# EAGLE design pam-controller (EAGLE 9.6.2)
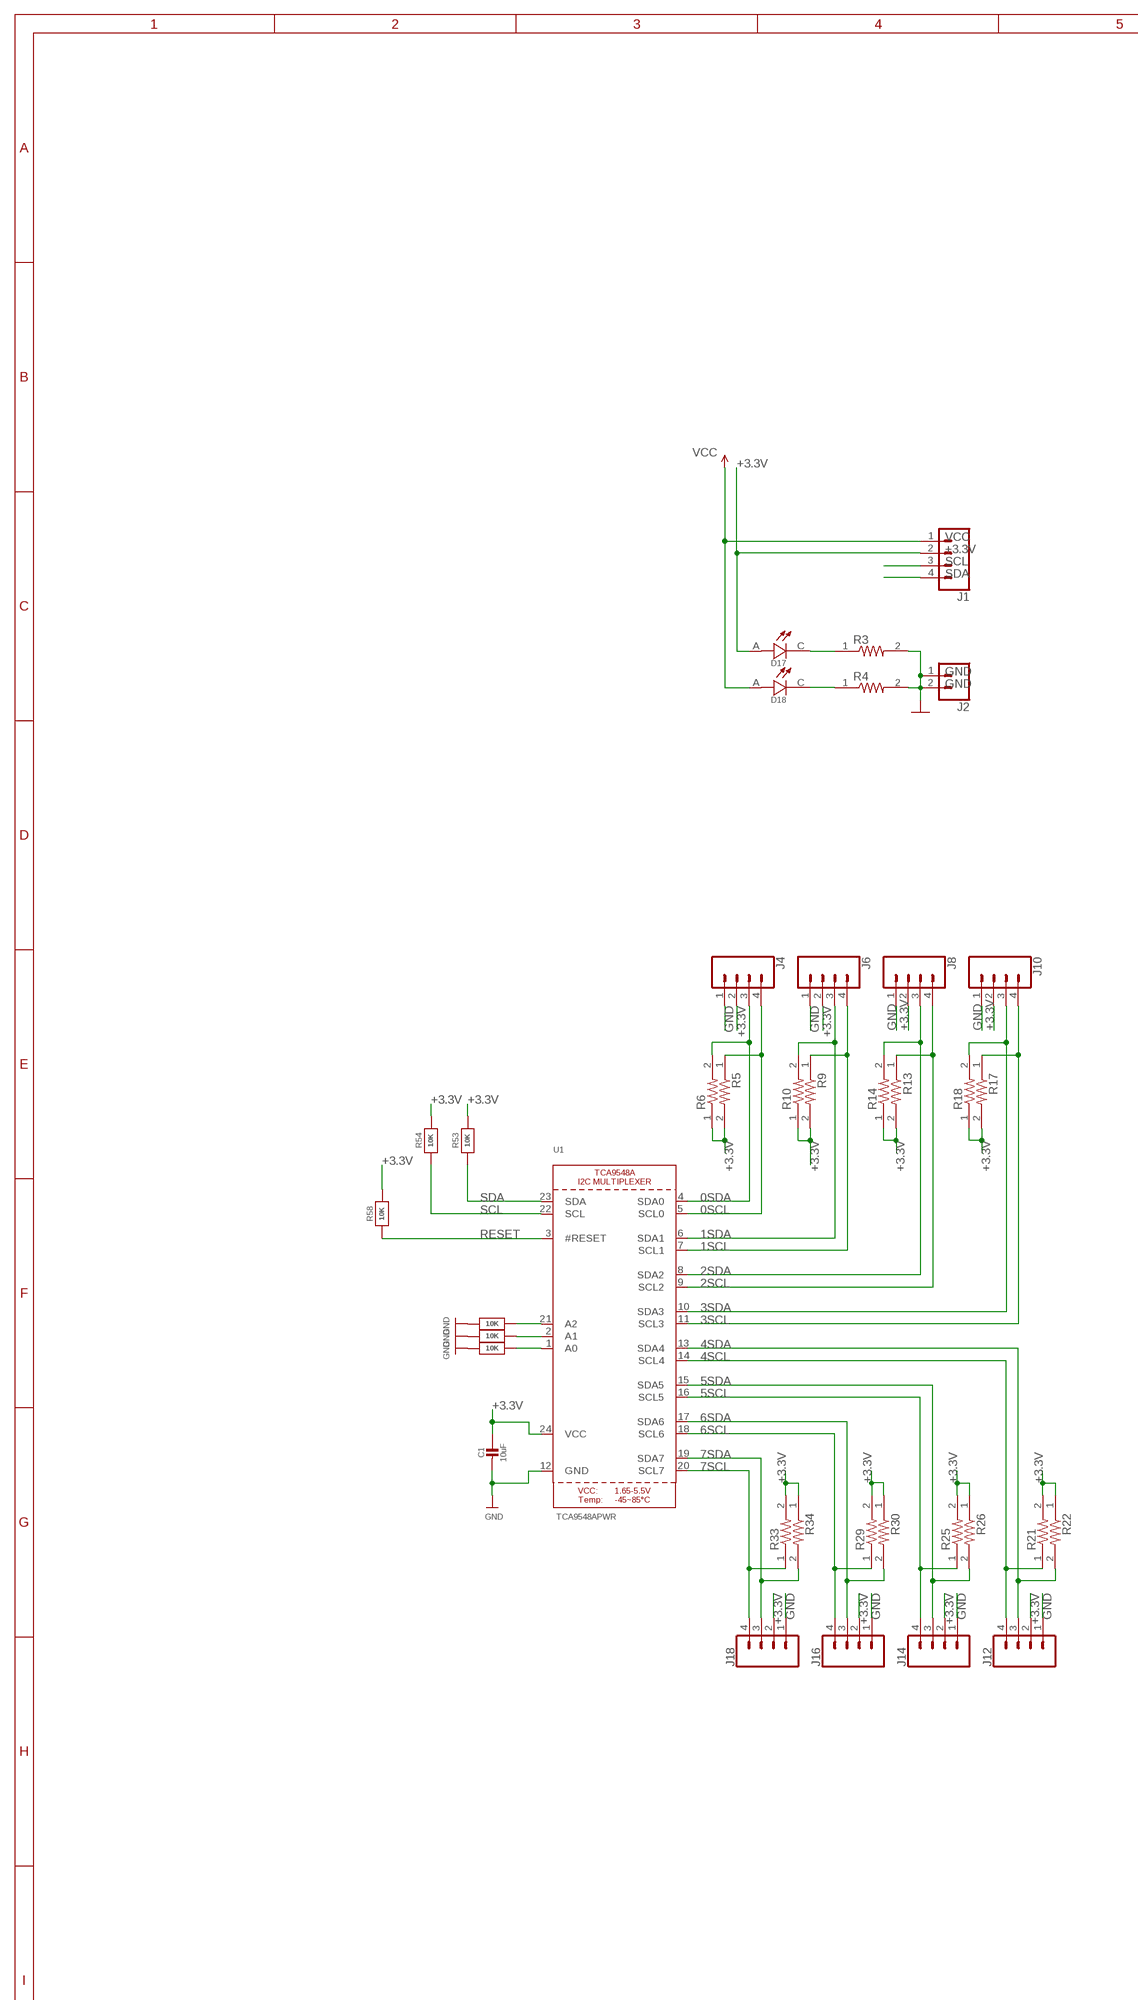
[diagram p0: schematic, sheet 1, part 1 of 2]
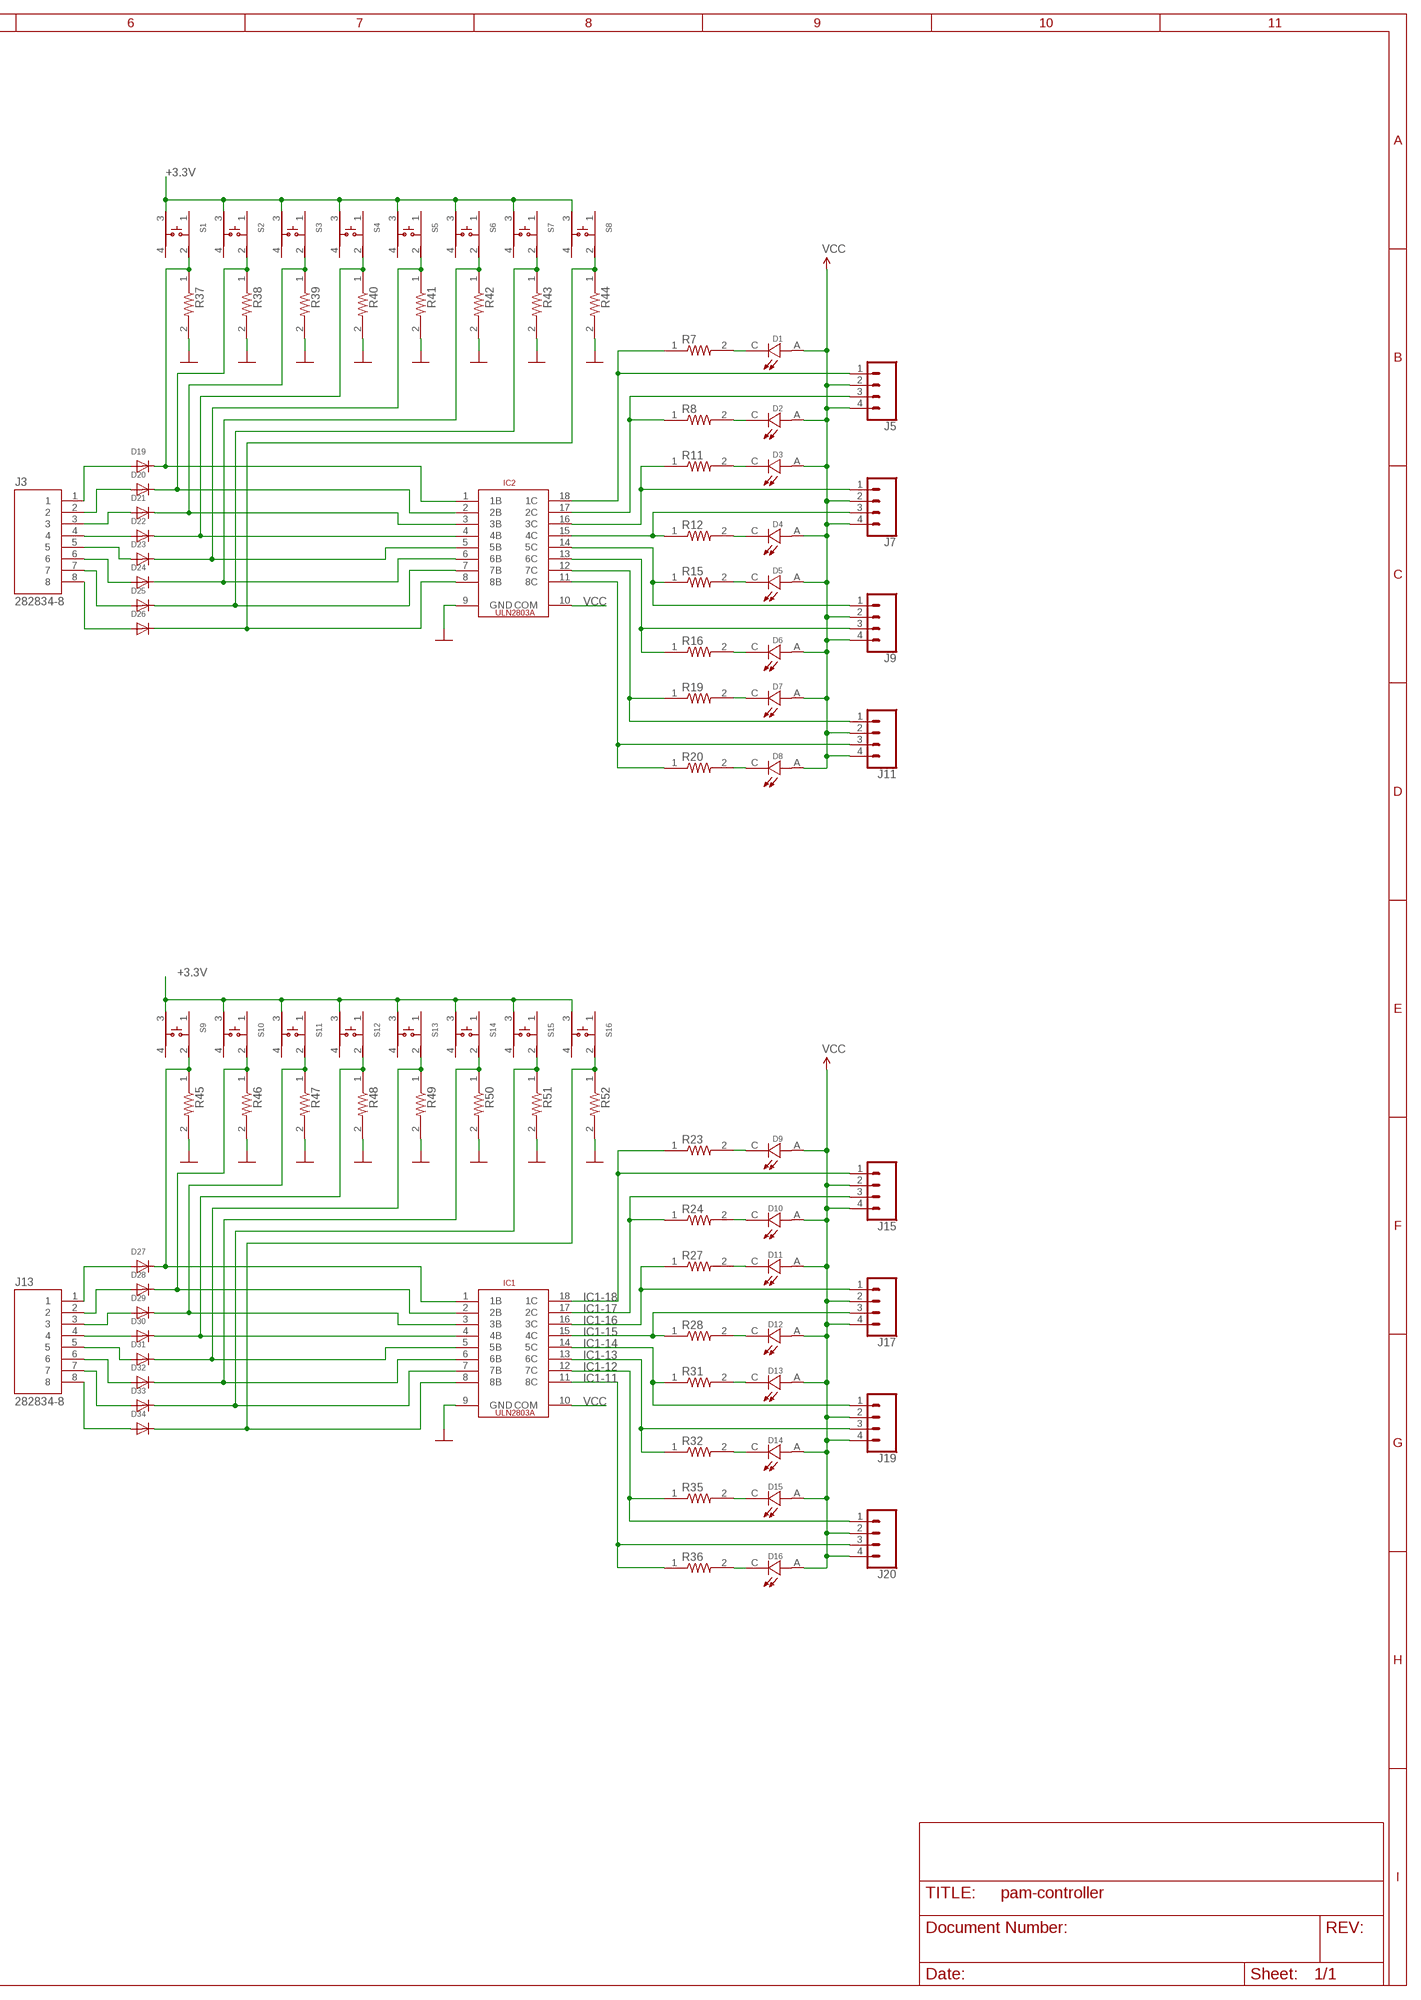
[diagram p1: schematic, sheet 1, part 2 of 2]

## Parts
C1  10uF  CAP_CERAMIC0805-NOOUTLINE  [0805-NO]
D1  LTST-C190KGKT  [LEDC1608X35N]
D2  LTST-C190KGKT  [LEDC1608X35N]
D3  LTST-C190KGKT  [LEDC1608X35N]
D4  LTST-C190KGKT  [LEDC1608X35N]
D5  LTST-C190KGKT  [LEDC1608X35N]
D6  LTST-C190KGKT  [LEDC1608X35N]
D7  LTST-C190KGKT  [LEDC1608X35N]
D8  LTST-C190KGKT  [LEDC1608X35N]
D9  LTST-C190KGKT  [LEDC1608X35N]
D10  LTST-C190KGKT  [LEDC1608X35N]
D11  LTST-C190KGKT  [LEDC1608X35N]
D12  LTST-C190KGKT  [LEDC1608X35N]
D13  LTST-C190KGKT  [LEDC1608X35N]
D14  LTST-C190KGKT  [LEDC1608X35N]
D15  LTST-C190KGKT  [LEDC1608X35N]
D16  LTST-C190KGKT  [LEDC1608X35N]
D17  LTST-C190KGKT  [LEDC1608X35N]
D18  LTST-C190KGKT  [LEDC1608X35N]
D19  DIODESOD-523  [SOD-523]
D20  DIODESOD-523  [SOD-523]
D21  DIODESOD-523  [SOD-523]
D22  DIODESOD-523  [SOD-523]
D23  DIODESOD-523  [SOD-523]
D24  DIODESOD-523  [SOD-523]
D25  DIODESOD-523  [SOD-523]
D26  DIODESOD-523  [SOD-523]
D27  DIODESOD-523  [SOD-523]
D28  DIODESOD-523  [SOD-523]
D29  DIODESOD-523  [SOD-523]
D30  DIODESOD-523  [SOD-523]
D31  DIODESOD-523  [SOD-523]
D32  DIODESOD-523  [SOD-523]
D33  DIODESOD-523  [SOD-523]
D34  DIODESOD-523  [SOD-523]
IC1  ULN2803A  [ULN2803A]
IC2  ULN2803A  [ULN2803A]
J1  CONN_04POLAR  [MOLEX-1X4]
J2  CONN_02POLAR  [MOLEX-1X2]
J3  282834-8  [TE_282834-8]
J4  CONN_04POLAR  [MOLEX-1X4]
J5  CONN_04POLAR  [MOLEX-1X4]
J6  CONN_04POLAR  [MOLEX-1X4]
J7  CONN_04POLAR  [MOLEX-1X4]
J8  CONN_04POLAR  [MOLEX-1X4]
J9  CONN_04POLAR  [MOLEX-1X4]
J10  CONN_04POLAR  [MOLEX-1X4]
J11  CONN_04POLAR  [MOLEX-1X4]
J12  CONN_04POLAR  [MOLEX-1X4]
J13  282834-8  [TE_282834-8]
J14  CONN_04POLAR  [MOLEX-1X4]
J15  CONN_04POLAR  [MOLEX-1X4]
J16  CONN_04POLAR  [MOLEX-1X4]
J17  CONN_04POLAR  [MOLEX-1X4]
J18  CONN_04POLAR  [MOLEX-1X4]
J19  CONN_04POLAR  [MOLEX-1X4]
J20  CONN_04POLAR  [MOLEX-1X4]
R3  1K  RC0603FR-071KL  [RESC1607X60N]
R4  1K  RC0603FR-071KL  [RESC1607X60N]
R5  1K  RC0603FR-071KL  [RESC1607X60N]
R6  1K  RC0603FR-071KL  [RESC1607X60N]
R7  1K  RC0603FR-071KL  [RESC1607X60N]
R8  1K  RC0603FR-071KL  [RESC1607X60N]
R9  1K  RC0603FR-071KL  [RESC1607X60N]
R10  1K  RC0603FR-071KL  [RESC1607X60N]
R11  1K  RC0603FR-071KL  [RESC1607X60N]
R12  1K  RC0603FR-071KL  [RESC1607X60N]
R13  1K  RC0603FR-071KL  [RESC1607X60N]
R14  1K  RC0603FR-071KL  [RESC1607X60N]
R15  1K  RC0603FR-071KL  [RESC1607X60N]
R16  1K  RC0603FR-071KL  [RESC1607X60N]
R17  1K  RC0603FR-071KL  [RESC1607X60N]
R18  1K  RC0603FR-071KL  [RESC1607X60N]
R19  1K  RC0603FR-071KL  [RESC1607X60N]
R20  1K  RC0603FR-071KL  [RESC1607X60N]
R21  1K  RC0603FR-071KL  [RESC1607X60N]
R22  1K  RC0603FR-071KL  [RESC1607X60N]
R23  1K  RC0603FR-071KL  [RESC1607X60N]
R24  1K  RC0603FR-071KL  [RESC1607X60N]
R25  1K  RC0603FR-071KL  [RESC1607X60N]
R26  1K  RC0603FR-071KL  [RESC1607X60N]
R27  1K  RC0603FR-071KL  [RESC1607X60N]
R28  1K  RC0603FR-071KL  [RESC1607X60N]
R29  1K  RC0603FR-071KL  [RESC1607X60N]
R30  1K  RC0603FR-071KL  [RESC1607X60N]
R31  1K  RC0603FR-071KL  [RESC1607X60N]
R32  1K  RC0603FR-071KL  [RESC1607X60N]
R33  1K  RC0603FR-071KL  [RESC1607X60N]
R34  1K  RC0603FR-071KL  [RESC1607X60N]
R35  1K  RC0603FR-071KL  [RESC1607X60N]
R36  1K  RC0603FR-071KL  [RESC1607X60N]
R37  1K  RC0603FR-071KL  [RESC1607X60N]
R38  1K  RC0603FR-071KL  [RESC1607X60N]
R39  1K  RC0603FR-071KL  [RESC1607X60N]
R40  1K  RC0603FR-071KL  [RESC1607X60N]
R41  1K  RC0603FR-071KL  [RESC1607X60N]
R42  1K  RC0603FR-071KL  [RESC1607X60N]
R43  1K  RC0603FR-071KL  [RESC1607X60N]
R44  1K  RC0603FR-071KL  [RESC1607X60N]
R45  1K  RC0603FR-071KL  [RESC1607X60N]
R46  1K  RC0603FR-071KL  [RESC1607X60N]
R47  1K  RC0603FR-071KL  [RESC1607X60N]
R48  1K  RC0603FR-071KL  [RESC1607X60N]
R49  1K  RC0603FR-071KL  [RESC1607X60N]
R50  1K  RC0603FR-071KL  [RESC1607X60N]
R51  1K  RC0603FR-071KL  [RESC1607X60N]
R52  1K  RC0603FR-071KL  [RESC1607X60N]
R53  10K  RESISTOR0805_NOOUTLINE  [0805-NO]
R54  10K  RESISTOR0805_NOOUTLINE  [0805-NO]
R55  10K  RESISTOR0805_NOOUTLINE  [0805-NO]
R56  10K  RESISTOR0805_NOOUTLINE  [0805-NO]
R57  10K  RESISTOR0805_NOOUTLINE  [0805-NO]
R58  10K  RESISTOR0805_NOOUTLINE  [0805-NO]
S1  SKRPACE010  [SW_SKRPACE010]
S2  SKRPACE010  [SW_SKRPACE010]
S3  SKRPACE010  [SW_SKRPACE010]
S4  SKRPACE010  [SW_SKRPACE010]
S5  SKRPACE010  [SW_SKRPACE010]
S6  SKRPACE010  [SW_SKRPACE010]
S7  SKRPACE010  [SW_SKRPACE010]
S8  SKRPACE010  [SW_SKRPACE010]
S9  SKRPACE010  [SW_SKRPACE010]
S10  SKRPACE010  [SW_SKRPACE010]
S11  SKRPACE010  [SW_SKRPACE010]
S12  SKRPACE010  [SW_SKRPACE010]
S13  SKRPACE010  [SW_SKRPACE010]
S14  SKRPACE010  [SW_SKRPACE010]
S15  SKRPACE010  [SW_SKRPACE010]
S16  SKRPACE010  [SW_SKRPACE010]
U1  TCA9548APWR  TCA9548A  [TSSOP24]

## Nets
0SCL: J4.4 R5.1 U1.5(SCL0)
0SDA: J4.3 R6.2 U1.4(SDA0)
1SCL: J6.4 R9.1 U1.7(SCL1)
1SDA: J6.3 R10.2 U1.6(SDA1)
2SCL: J8.4 R13.1 U1.9(SCL2)
2SDA: J8.3 R14.2 U1.8(SDA2)
3SCL: J10.4 R17.1 U1.11(SCL3)
3SDA: J10.3 R18.2 U1.10(SDA3)
4SCL: J12.4 R21.1 U1.14(SCL4)
4SDA: J12.3 R22.2 U1.13(SDA4)
5SCL: J14.4 R25.1 U1.16(SCL5)
5SDA: J14.3 R26.2 U1.15(SDA5)
6SCL: J16.4 R29.1 U1.18(SCL6)
6SDA: J16.3 R30.2 U1.17(SDA6)
7SCL: J18.4 R33.1 U1.20(SCL7)
7SDA: J18.3 R34.2 U1.19(SDA7)
+3.3V: C1.1 D17.A J1.2 J4.2 J6.2 J8.2 J10.2 J12.2 J14.2 J16.2 J18.2 R5.2 R6.1 R9.2 R10.1 R13.2 R14.1 R17.2 R18.1 R21.2 R22.1 R25.2 R26.1 R29.2 R30.1 R33.2 R34.1 R53.2 R54.2 R58.2 S1.3 S2.3 S3.3 S4.3 S5.3 S6.3 S7.3 S8.3 S9.3 S10.3 S11.3 S12.3 S13.3 S14.3 S15.3 S16.3 U1.24(VCC)
GND: C1.2 IC1.9(GND) IC2.9(GND) J2.1 J2.2 J4.1 J6.1 J8.1 J10.1 J12.1 J14.1 J16.1 J18.1 R3.2 R4.2 R37.2 R38.2 R39.2 R40.2 R41.2 R42.2 R43.2 R44.2 R45.2 R46.2 R47.2 R48.2 R49.2 R50.2 R51.2 R52.2 R55.2 R56.2 R57.2 U1.12(GND)
IC1-11: IC1.11(8C) J20.3 R36.1
IC1-12: IC1.12(7C) J20.1 R35.1
IC1-13: IC1.13(6C) J19.3 R32.1
IC1-14: IC1.14(5C) J19.1 R31.1
IC1-15: IC1.15(4C) J17.3 R28.1
IC1-16: IC1.16(3C) J17.1 R27.1
IC1-17: IC1.17(2C) J15.3 R24.1
IC1-18: IC1.18(1C) J15.1 R23.1
IC2-11: IC2.11(8C) J11.3 R20.1
IC2-12: IC2.12(7C) J11.1 R19.1
IC2-13: IC2.13(6C) J9.3 R16.1
IC2-14: IC2.14(5C) J9.1 R15.1
IC2-15: IC2.15(4C) J7.3 R12.1
IC2-16: IC2.16(3C) J7.1 R11.1
IC2-17: IC2.17(2C) J5.3 R8.1
IC2-18: IC2.18(1C) J5.1 R7.1
N$1: D19.K(C) IC2.1(1B) R37.1 S1.2
N$2: D19.A J3.1
N$3: D20.A J3.2
N$4: D21.A J3.3
N$5: D22.A J3.4
N$6: D23.A J3.5
N$7: D24.A J3.6
N$8: D25.A J3.7
N$9: D27.A J13.1
N$10: D27.K(C) IC1.1(1B) R45.1 S9.2
N$11: R56.1 U1.2(A1)
N$12: R57.1 U1.1(A0)
N$13: D28.K(C) IC1.2(2B) R46.1 S10.2
N$14: R55.1 U1.21(A2)
N$18: D30.A J13.4
N$19: D28.A J13.2
N$21: D29.A J13.3
N$22: D34.A J13.8
N$23: D33.A J13.7
N$26: D14.C R32.2
N$27: D15.C R35.2
N$30: D26.A J3.8
N$32: D32.A J13.6
N$34: D20.K(C) IC2.2(2B) R38.1 S2.2
N$36: D21.K(C) IC2.3(3B) R39.1 S3.2
N$37: D22.K(C) IC2.4(4B) R40.1 S4.2
N$38: D23.K(C) IC2.5(5B) R41.1 S5.2
N$39: D24.K(C) IC2.6(6B) R42.1 S6.2
N$40: D25.K(C) IC2.7(7B) R43.1 S7.2
N$41: D26.K(C) IC2.8(8B) R44.1 S8.2
N$42: D29.K(C) IC1.3(3B) R47.1 S11.2
N$43: D31.A J13.5
N$44: D30.K(C) IC1.4(4B) R48.1 S12.2
N$45: D31.K(C) IC1.5(5B) R49.1 S13.2
N$46: D32.K(C) IC1.6(6B) R50.1 S14.2
N$47: D33.K(C) IC1.7(7B) R51.1 S15.2
N$48: D34.K(C) IC1.8(8B) R52.1 S16.2
N$49: D16.C R36.2
N$50: D12.C R28.2
N$51: D13.C R31.2
N$52: D11.C R27.2
N$53: D10.C R24.2
N$54: D9.C R23.2
N$55: D8.C R20.2
N$56: D7.C R19.2
N$59: D6.C R16.2
N$60: D1.C R7.2
N$61: D17.C R3.1
N$62: D18.C R4.1
N$63: D5.C R15.2
N$64: D4.C R12.2
N$65: D3.C R11.2
N$66: D2.C R8.2
RESET: R58.1 U1.3(#RESET)
SCL: J1.4 R54.1 U1.22(SCL)
SDA: J1.3 R53.1 U1.23(SDA)
VCC: D1.A D2.A D3.A D4.A D5.A D6.A D7.A D8.A D9.A D10.A D11.A D12.A D13.A D14.A D15.A D16.A D18.A IC1.10(COM) IC2.10(COM) J1.1 J5.2 J5.4 J7.2 J7.4 J9.2 J9.4 J11.2 J11.4 J15.2 J15.4 J17.2 J17.4 J19.2 J19.4 J20.2 J20.4
Unconnected: S1.1 S1.4 S2.1 S2.4 S3.1 S3.4 S4.1 S4.4 S5.1 S5.4 S6.1 S6.4 S7.1 S7.4 S8.1 S8.4 S9.1 S9.4 S10.1 S10.4 S11.1 S11.4 S12.1 S12.4 S13.1 S13.4 S14.1 S14.4 S15.1 S15.4 S16.1 S16.4

## Library data of the parts
C1 = microbuilder:CAP_CERAMIC: Ceramic Capacitors For new designs, use the packages preceded by an '_' character since they are more reliable: The following footprints should be used on most boards: _0402 - Standard footprint for regular board layouts _0603 - Standard footprint for regular board layouts _0805 - Standard footprint for regular board layouts _1206 - Standard footprint for regular board layouts For extremely tight-pitch boards where space is at a premium, the following 'micro-pitch' footprints can be used (smaller pads, no silkscreen outline, etc.): _0402MP - Micro-pitch footprint for very dense/compact boards _0603MP - Micro-pitch footprint for very dense/compact boards _0805MP - Micro-pitch footprint for very dense/compact boards _1206MP - Micro-pitch footprint for very dense/compact boards
D1-D18 = LTST-C190KGKT:LTST-C190KGKT
D19-D34 = adafruit:DIODE: Diode SMADIODE - SMA Surface Mount Package 20V 1A Schottky Diode Digikey: 641-1014-6-ND DO-1N4148 - Through Hole Small Current Diode SOD-123 20V 1 A (.5mV Vf) Schottky Diode - Digikey: MBRX120TPMSCT-ND SOD-323 10V 570mA (.38mV Vf, 3ns) Schottky Diode - Digikey: ZLLS410CT-ND SOD-523 30V 30mA Schottky Diode (RB751S-40TE61) - Digikey: RB751S-40TE61CT-ND SOT23-R/W - SOT23 Package (R = Solder Paste/Reflow Ovens, W = Hand-Soldering) BAT54Film 40V 300mA - Digikey: 497-7162-1-ND
IC1 IC2 = ULN2803A:ULN2803A: ULN2803A Octal Darlington Driver Check availability <https://pricing.snapeda.com/parts/ULN2803A/STMicroelectronics/view-part?ref=eda>; AVAILABILITY: In Stock; CHECK_PRICES: https://www.snapeda.com/parts/ULN2803A/STMicroelectronics/view-part/?ref=eda; DESCRIPTION: Bipolar (BJT) Transistor Array 8 NPN Darlington 50V 500mA - 2.25W Through Hole 18-DIP; MF: STMicroelectronics; MP: ULN2803A; PACKAGE: DIP-18 Allegro MicroSystems LLC; PRICE: None; SNAPEDA_LINK: https://www.snapeda.com/parts/ULN2803A/STMicroelectronics/view-part/?ref=snap
J1 J4-J12 J14-J20 = SparkFun-Connectors:CONN_04: Multi connection point. Often used as Generic Header-pin footprint for 0.1 inch spaced/style header connections On any of the 0.1 inch spaced packages, you can populate with these: Break Away Headers - Straight <https://www.sparkfun.com/products/116> (PRT-00116) Break Away Male Headers - Right Angle <https://www.sparkfun.com/products/553> (PRT-00553) Female Headers <https://www.sparkfun.com/products/115> (PRT-00115) Break Away Headers - Machine Pin <https://www.sparkfun.com/products/117> (PRT-00117) Break Away Female Headers - Swiss Machine Pin <https://www.sparkfun.com/products/743> (PRT-00743) For SCREWTERMINALS and SPRING TERMINALS visit here: Screw Terimnals on SparkFun.com <https://www.sparkfun.com/search/results?term=Screw+Terminals> (5mm/3.5mm/2.54mm spacing) This device is also useful as a general connection point to wire up your design to another part of your project. Our various solder wires solder well into these plated through hole pads. Hook-Up Wire - Assortment (Stranded, 22 AWG) <https://www.sparkfun.com/products/11375> (PRT-11375) Hook-Up Wire - Assortment (Solid Core, 22 AWG) <https://www.sparkfun.com/products/11367> (PRT-11367) View the entire wire category on our website here <https://www.sparkfun.com/categories/141> Special notes: Molex polarized connector foot print use with SKU : PRT-08231 with associated crimp pins and housings. 1MM SMD Version SKU: PRT-10208; PROD_ID: CONN-08186; SF_ID: PRT-08231
J2 = SparkFun-Connectors:CONN_02: Multi connection point. Often used as Generic Header-pin footprint for 0.1 inch spaced/style header connections On any of the 0.1 inch spaced packages, you can populate with these: Break Away Headers - Straight <https://www.sparkfun.com/products/116> (PRT-00116) Break Away Male Headers - Right Angle <https://www.sparkfun.com/products/553> (PRT-00553) Female Headers <https://www.sparkfun.com/products/115> (PRT-00115) Break Away Headers - Machine Pin <https://www.sparkfun.com/products/117> (PRT-00117) Break Away Female Headers - Swiss Machine Pin <https://www.sparkfun.com/products/743> (PRT-00743) For SCREWTERMINALS and SPRING TERMINALS visit here: Screw Terimnals on SparkFun.com <https://www.sparkfun.com/search/results?term=Screw+Terminals> (5mm/3.5mm/2.54mm spacing) This device is also useful as a general connection point to wire up your design to another part of your project. Our various solder wires solder well into these plated through hole pads. Hook-Up Wire - Assortment (Stranded, 22 AWG) <https://www.sparkfun.com/products/11375> (PRT-11375) Hook-Up Wire - Assortment (Solid Core, 22 AWG) <https://www.sparkfun.com/products/11367> (PRT-11367) View the entire wire category on our website here <https://www.sparkfun.com/categories/141> Special notes: Molex polarized connector foot print use with: PRT-08233 with associated crimp pins and housings. 2.54_SCREWTERM for use with PRT-10571. 3.5mm Screw Terminal footprints for PRT-08084 5mm Screw Terminal footprints for use with PRT-08432; SF_ID: PRT-09918
J3 J13 = 282834-8:282834-8; MANUFACTURER: TE Connectivity; MAXIMUM_PACKAGE_HEIGHT: 10 mm; PARTREV: D; SNAPEDA_PN: 282834-8; STANDARD: Manufacturer Recommendations
R3-R52 = RC0603FR-071KL:RC0603FR-071KL
R53-R58 = microbuilder:RESISTOR: Resistors For new designs, use the packages preceded by an '_' character since they are more reliable: The following footprints should be used on most boards: _0402 - Standard footprint for regular board layouts _0603 - Standard footprint for regular board layouts _0805 - Standard footprint for regular board layouts _1206 - Standard footprint for regular board layouts For extremely tight-pitch boards where space is at a premium, the following 'micro-pitch' footprints can be used (smaller pads, no silkscreen outline, etc.): _0402MP - Micro-pitch footprint for very dense/compact boards _0603MP - Micro-pitch footprint for very dense/compact boards _0805MP - Micro-pitch footprint for very dense/compact boards _1206MP - Micro-pitch footprint for very dense/compact boards
S1-S16 = SKRPACE010:SKRPACE010; MANUFACTURER: ALPS; STANDARD: Maniufacturer Recommendations
U1 = microbuilder:TCA9548A: TCA9548A I2C Multiplexer

## Board
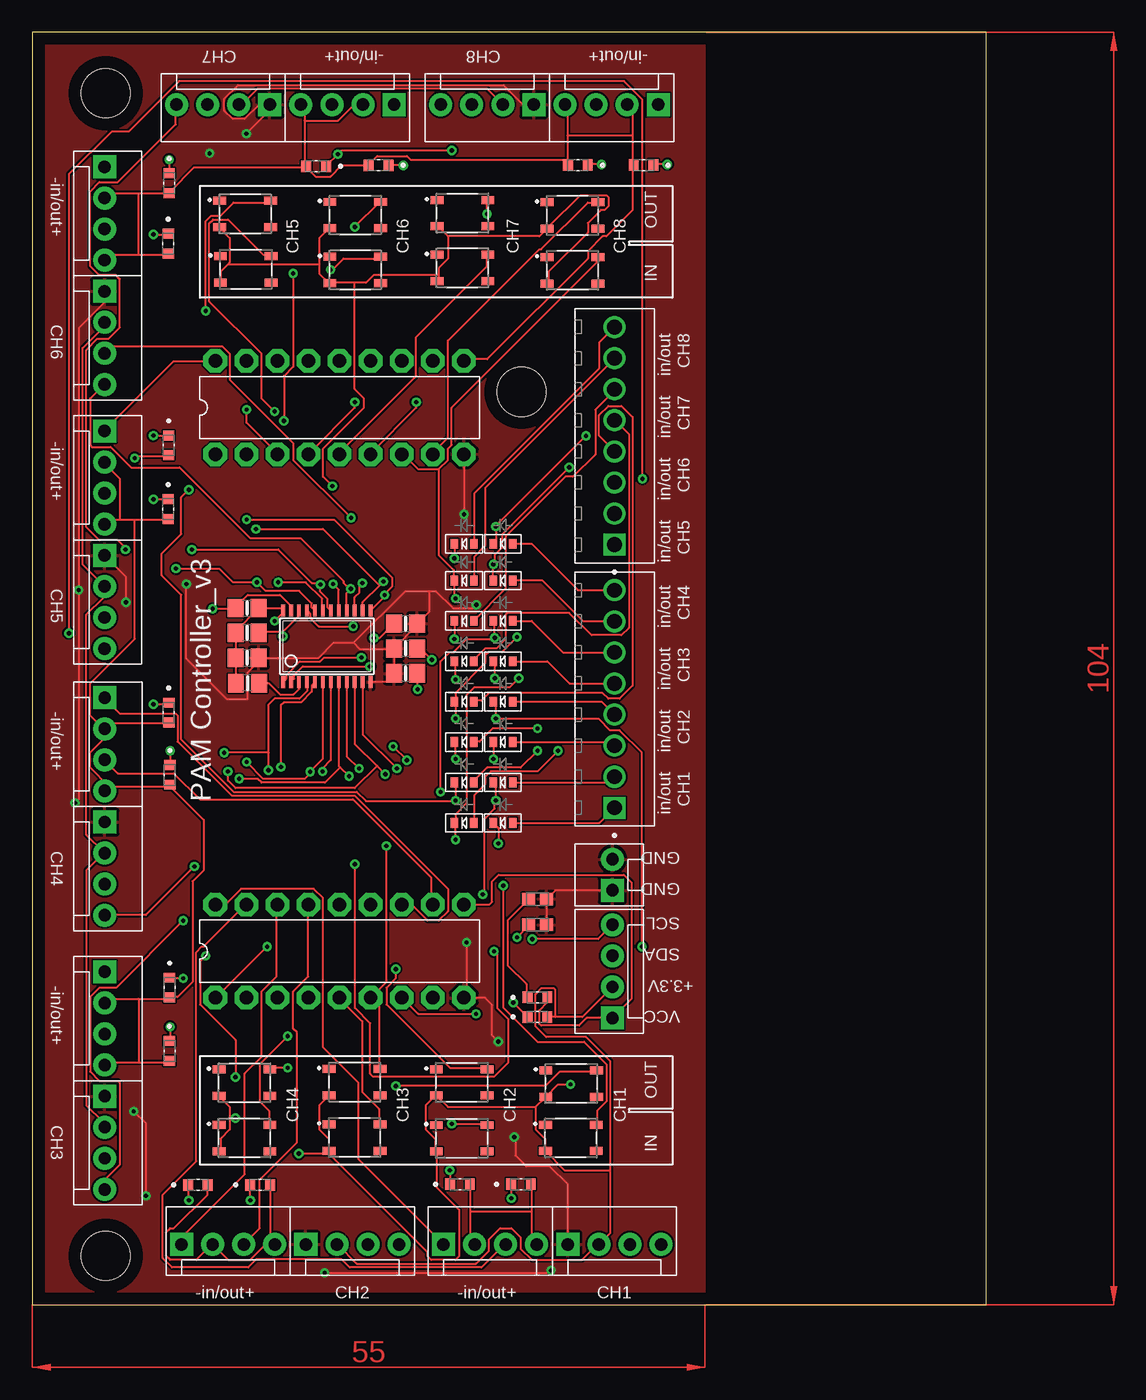
[diagram p2: board, top side]
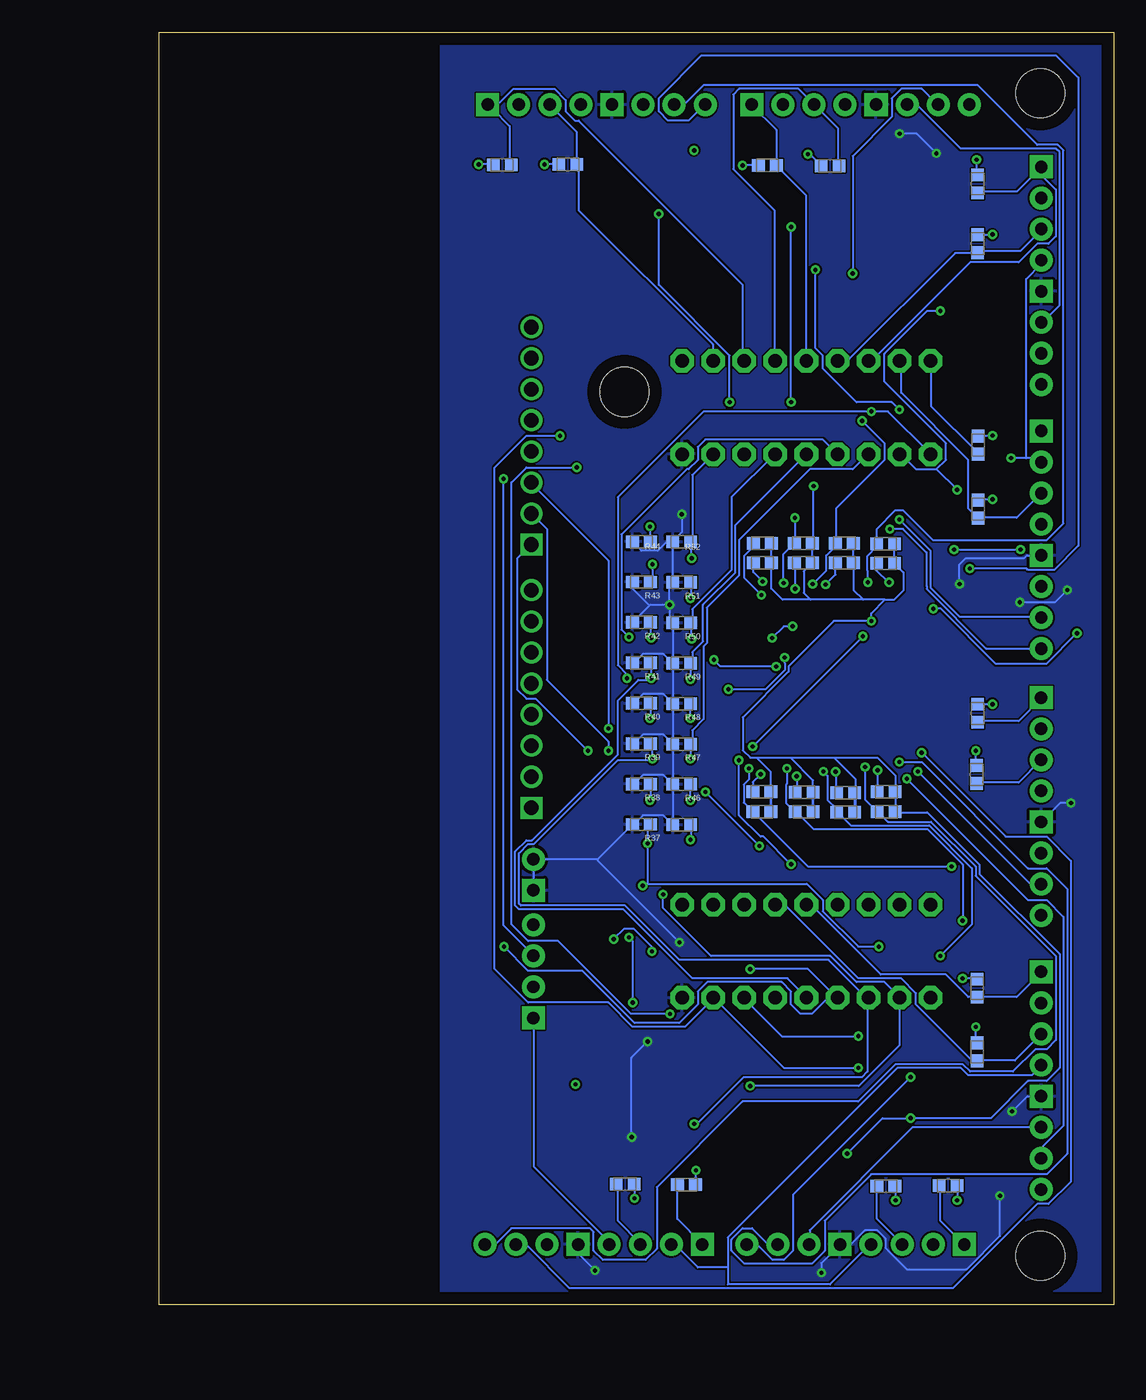
[diagram p3: board, bottom side, seen from below]

Size 78 x 104 mm. Coordinates in mm from the lower left corner, seen from the top.
Outline: 0,0 78,0 78,104 0,104 0,0
Copper layers (1*16): Top 0.035mm / dielectric 1.5mm / Bottom 0.035mm
Design rules "default *": minimum track width 6mil, minimum drill 0.35mm, track to track 6mil, track to pad 6mil, pad to pad 6mil, via to via 10mil, smd to smd 6mil, copper to edge 40mil, drill to drill 10mil, minimum pad ring 10mil, minimum via ring 8mil, stop-mask expansion 4mil, vias tented up to drill 0mil, thermal gap 10mil
Holes 4 mm at 40,74.6 6,99 6,4

### Footprints (pad centres in the part's own frame; a part is rotated, then mirrored left to right if it is on the bottom)
0805-NO = smd 1.3 x 1.5: 1 -0.95,0; 2 0.95,0
LEDC1608X35N = smd 0.81 x 0.93: A 0.81,0; C -0.81,0
SOD-523 = smd 0.8 x 0.6: A 0,-0.8; K 0,0.8
ULN2803A = drill 1.1 pad 1.93 octagon: 1 -3.81,8.89; 2 -3.81,6.35; 3 -3.81,3.81; 4 -3.81,1.27; 5 -3.81,-1.27; 6 -3.81,-3.81; 7 -3.81,-6.35; 8 -3.81,-8.89; 9 -3.81,-11.43; 10 3.81,-11.43; 11 3.81,-8.89; 12 3.81,-6.35; 13 3.81,-3.81; 14 3.81,-1.27; 15 3.81,1.27; 16 3.81,3.81; 17 3.81,6.35; 18 3.81,8.89
MOLEX-1X4 = drill 1.016 pad 1.88 square: 1 0,0 | drill 1.016 pad 1.88: 2 2.54,0; 3 5.08,0; 4 7.62,0
MOLEX-1X2 = drill 1.016 pad 1.88 square: 1 0,0 | drill 1.016 pad 1.88: 2 2.54,0
TE_282834-8 = drill 1.2 square: 1 -8.89,0 | drill 1.2: 2 -6.35,0; 3 -3.81,0; 4 -1.27,0; 5 1.27,0; 6 3.81,0; 7 6.35,0; 8 8.89,0
RESC1607X60N = smd 1.04 x 1.02: 1 -0.735,0; 2 0.735,0
SW_SKRPACE010 = smd 1.05 x 0.65: 1 -2.075,1.075; 2 2.075,1.075; 3 -2.075,-1.075; 4 2.075,-1.075
TSSOP24 = smd 0.305 x 0.991: 1 -3.575,-2.918; 2 -2.925,-2.918; 3 -2.275,-2.918; 4 -1.625,-2.918; 5 -0.975,-2.918; 6 -0.325,-2.918; 7 0.325,-2.918; 8 0.975,-2.918; 9 1.625,-2.918; 10 2.275,-2.918; 11 2.925,-2.918; 12 3.575,-2.918; 13 3.575,2.918; 14 2.925,2.918; 15 2.275,2.918; 16 1.625,2.918; 17 0.975,2.918; 18 0.325,2.918; 19 -0.325,2.918; 20 -0.975,2.918; 21 -1.625,2.918; 22 -2.275,2.918; 23 -2.925,2.918; 24 -3.575,2.918

### Placement (x,y rotation side)
C1  17.57,52.87 0 top
D1  34.96,9.85 0 top
D2  39.94,9.84 0 top
D3  13.55,9.79 0 top
D4  18.63,9.78 0 top
D5  11.22,25.91 270 top
D6  11.22,20.73 270 top
D7  11.16,48.38 270 top
D8  11.26,43.3 270 top
D9  11.16,70.24 270 top
D10  11.11,65.02 270 top
D11  11.2,91.67 270 top
D12  11.12,86.71 270 top
D13  28.31,93.12 180 top
D14  23.21,93.04 180 top
D15  49.98,93.14 180 top
D16  44.6,93.14 180 top
D17  41.29,23.51 0 top
D18  41.29,25.13 0 top
D19  38.48,39.38 90 top
D20  38.48,42.68 90 top
D21  38.48,45.98 90 top
D22  38.48,49.28 90 top
D23  38.48,52.58 90 top
D24  38.48,55.89 90 top
D25  38.48,59.19 90 top
D26  38.48,62.19 90 top
D27  35.31,39.38 90 top
D28  35.31,42.68 90 top
D29  35.31,45.98 90 top
D30  35.31,49.28 90 top
D31  35.31,52.58 90 top
D32  35.31,55.89 90 top
D33  35.31,59.19 90 top
D34  35.31,62.19 90 top
IC1  23.85,73.32 90 top
IC2  23.85,28.89 90 top
J1  47.43,23.43 90 top
J2  47.43,33.86 90 top
J3  47.6,49.5 90 top
J4  43.78,4.93 0 top
J5  33.62,4.93 0 top
J6  22.37,4.93 0 top
J7  12.21,4.93 0 top
J8  5.93,17.04 270 top
J9  5.93,27.2 270 top
J10  5.93,39.45 270 top
J11  5.93,49.61 270 top
J12  5.92,61.24 270 top
J13  47.6,71.01 90 top
J14  5.92,82.83 270 top
J15  5.92,71.4 270 top
J16  19.42,98.08 180 top
J17  5.92,92.99 270 top
J18  41.01,98.08 180 top
J19  29.58,98.08 180 top
J20  51.17,98.08 180 top
R3  41.3,31.05 0 top
R4  41.3,33.14 0 top
R5  18.6,40.29 0 bottom
R6  18.6,41.91 180 bottom
R7  34.93,9.8 0 bottom
R8  39.93,9.87 0 bottom
R9  21.9,40.24 0 bottom
R10  21.9,41.86 180 bottom
R11  13.53,9.74 0 bottom
R12  18.63,9.71 0 bottom
R13  25.3,40.27 0 bottom
R14  25.3,41.88 180 bottom
R15  11.18,25.87 90 bottom
R16  11.15,20.67 90 bottom
R17  28.76,40.3 0 bottom
R18  28.76,41.91 180 bottom
R19  11.12,48.33 90 bottom
R20  11.19,43.33 90 bottom
R21  28.72,60.62 0 bottom
R22  28.72,62.21 180 bottom
R23  11.11,70.26 90 bottom
R24  11.08,65.02 90 bottom
R25  25.36,60.65 0 bottom
R26  25.36,62.24 180 bottom
R27  11.13,91.6 90 bottom
R28  11.12,86.72 90 bottom
R29  22.01,60.62 0 bottom
R30  22.01,62.21 180 bottom
R31  28.3,93.11 180 bottom
R32  23.18,93.06 180 bottom
R33  18.65,60.6 0 bottom
R34  18.65,62.18 180 bottom
R35  49.98,93.15 180 bottom
R36  44.62,93.18 180 bottom
R37  38.61,39.25 180 bottom
R38  38.61,42.55 180 bottom
R39  38.61,45.85 180 bottom
R40  38.61,49.15 180 bottom
R41  38.61,52.46 180 bottom
R42  38.61,55.76 180 bottom
R43  38.61,59.06 180 bottom
R44  38.61,62.36 180 bottom
R45  35.31,39.22 180 bottom
R46  35.31,42.52 180 bottom
R47  35.31,45.82 180 bottom
R48  35.31,49.12 180 bottom
R49  35.31,52.43 180 bottom
R50  35.31,55.73 180 bottom
R51  35.31,59.03 180 bottom
R52  35.31,62.33 180 bottom
R53  17.57,56.93 0 top
R54  17.57,54.9 180 top
R55  30.53,55.66 0 top
R56  30.53,53.63 180 top
R57  30.53,51.6 180 top
R58  17.6,50.8 180 top
S1  44.03,13.63 0 top
S2  44.06,18.08 0 top
S3  35.11,13.6 0 top
S4  35.11,18.17 0 top
S5  26.35,13.67 0 top
S6  26.35,18.19 0 top
S7  17.35,13.62 0 top
S8  17.35,18.14 0 top
S9  17.46,84.61 0 top
S10  17.41,89.14 0 top
S11  26.41,84.57 0 top
S12  26.41,89.05 0 top
S13  35.17,84.73 0 top
S14  35.17,89.21 0 top
S15  44.17,84.54 0 top
S16  44.17,89.03 0 top
U1  24.08,53.81 0 top

### Tracks (layer width: path | path; a pad name or v marks a point on that pad's centre or on a via)
0SCL  (via drill 0.35)
  Top 0.152: U1.5 22.84,50.62 22.84,50.09 21.97,49.23 20.57,49.23 20.32,48.97 v20.32,43.94
  Bottom 0.152: v20.32,43.94 20.32,41.28 R5.1 19.2,40.23 18.44,39.47 14.94,39.47 11.28,35.81 11.28,35.05 4.72,28.5 4.72,21.64 5.49,20.88 6.4,20.88 8.23,19.05 11.73,19.05 12.34,19.66 17.83,19.66 20.88,16.61 30.33,16.61 37.34,9.6 37.34,4.57 38.25,3.66 41.76,3.66 42.52,4.42 42.52,5.94 42.82,6.25 49.23,6.25 50.44,5.03 51.36,5.03 J4.4
0SDA  (via drill 0.35)
  Top 0.152: U1.4 22.46,50.15 21.84,49.53 19.81,49.53 19.3,49.02 19.3,45.11 | 19.3,45.11 v19.3,43.69 | 19.3,45.11 v15.7,45.11 | 19.36,45.11 19.3,45.11
  Bottom 0.152: v19.3,43.69 19.3,41.94 R6.2 | v15.7,45.11 8.84,38.25 5.49,38.25 3.5,36.27 3.5,10.06 5.33,8.23 6.25,8.23 13.13,1.34 44.47,1.34 48.01,4.88 48.77,4.88 J4.3
1SCL  (via drill 0.35)
  Top 0.152: U1.7 24.41,44.51 23.74,43.84 v23.74,43.58 | v16.61,18.59 16.61,21.64 13.72,24.54 13.72,28.04 v14.17,28.5
  Bottom 0.152: v23.74,43.58 23.39,43.23 23.39,41.25 22.64,40.5 R9.1 22.55,40.23 21.49,39.17 15.09,39.17 11.58,35.66 11.58,31.09 v14.17,28.5 | v16.61,18.59 26.21,8.99 26.21,4.42 26.98,3.66 27.89,3.66 29.11,4.88 29.87,4.88 J6.4
1SDA  (via drill 0.35)
  Top 0.152: U1.6 23.76,44.6 v22.73,43.57 22.71,43.43 22.25,42.98 18.9,42.98 v17.53,44.35
  Bottom 0.152: v22.73,43.57 22.73,41.95 R10.2 | v17.53,44.35 15.7,44.35 7.01,35.66 5.49,35.66 3.81,33.98 3.81,12.34 5.49,10.67 19.81,10.67 23.62,6.86 23.62,4.42 24.69,3.35 30.18,3.35 31.24,4.42 31.24,5.33 30.33,6.25 29.57,6.25 28.35,5.03 27.58,5.03 J6.3
2SCL  (via drill 0.35)
  Top 0.152: U1.9 25.71,44.82 v26.71,43.81 | v12.34,31.39 6.86,25.91 5.49,25.91 4.72,25.15 4.72,19.05 5.49,18.29 7.01,18.29 7.16,18.14 7.16,11.43 5.94,10.21 5.94,9.45 J8.4
  Bottom 0.152: v26.71,43.81 26.71,42.56 26.79,42.49 26.79,41.02 R13.1 25.91,40.23 24.54,38.86 15.24,38.86 12.34,35.97 v12.34,31.39
2SDA  (via drill 0.35)
  Top 0.152: U1.8 25.06,44.04 25.18,43.92 | 25.18,43.92 v25.91,43.19 | v16.92,42.98 18.44,42.98 18.75,42.67 23.93,42.67 25.18,43.92
  Bottom 0.152: v25.91,43.19 25.91,42.01 R14.2 | v16.92,42.98 7.01,33.07 5.49,33.07 4.12,31.7 4.12,14.63 5.79,12.95 5.79,12.04 J8.3
3SCL  (via drill 0.35)
  Top 0.152: U1.11 27.01,46.62 v29.81,43.81 | v13.26,35.81 9.3,31.85 5.94,31.85 J10.4
  Bottom 0.152: v29.81,43.81 29.81,42.94 30.24,42.51 30.24,41.05 R17.1 29.41,40.23 24.99,35.81 v13.26,35.81
3SDA  (via drill 0.35)
  Top 0.152: U1.10 26.36,45.84 28.18,44.02 | 28.18,44.02 v28.85,43.35 | v16,43.59 16,42.82 16.61,42.22 26.36,42.22 28.18,44.02 | 28.19,44.04 28.18,44.02
  Bottom 0.152: v28.85,43.35 29.5,42.7 R18.2 | v16,43.59 6.86,34.44 5.94,34.44 J10.3
4SCL  (via drill 0.35)
  Top 0.152: U1.14 27.01,57.42 28.38,58.79 | 28.38,58.79 v28.69,59.1 | 28.38,58.79 23.77,63.4 v18.29,63.4
  Bottom 0.152: v28.69,59.1 29.45,59.86 R21.1 | v18.29,63.4 17.22,63.4 15.31,61.49 15.31,58.73 15.29,58.71 15.29,58.49 10.45,53.65 5.94,53.65 J12.4
4SDA  (via drill 0.35)
  Top 0.152: U1.13 28.8,57.87 v28.8,58 28.8,58.06 29.41,58.67 29.41,59.44 24.69,64.16 v17.53,64.16
  Bottom 0.152: R22.2 29.45,61.97 30.2,61.23 30.2,59.4 v28.8,58 | v17.53,64.16 14.98,61.62 14.98,58.61 12.61,56.24 5.94,56.24 J12.3
5SCL  (via drill 0.35)
  Top 0.152: U1.16 25.71,58.17 v26.04,58.5 25.91,58.52 25.45,58.98 25.45,59.13 21.95,62.64 17.83,62.64 12.04,68.43 8.08,68.43 6.4,70.1 4.88,70.1 4.72,70.26 4.72,74.07 5.79,75.13 J14.4
  Bottom 0.152: v26.04,58.5 26.04,60.59 R25.1
5SDA  (via drill 0.35)
  Top 0.152: U1.15 26.36,57.82 26.74,58.21 26.74,58.74 v26.98,58.98 | v26.06,64.31 21.34,69.04 21.34,70.41 16.15,75.59 16.15,77.72 15.54,78.33 6.4,78.33 5.94,77.88 J14.3
  Bottom 0.152: v26.98,58.98 26.98,61.35 R26.2 26.06,62.33 v26.06,64.31
6SCL  (via drill 0.35)
  Top 0.152: U1.18 24.14,57 24.14,57.69 23.55,58.28 v23.55,58.85 23.47,58.98 22.86,58.98 20.12,61.72 v13.05,61.72 | v7.62,61.72 7.62,61.87 7.01,62.48 5.49,62.48 4.42,63.55 4.42,78.03 5.33,78.94 6.25,78.94 7.16,79.86 7.16,83.82 6.86,84.12 5.49,84.12 4.72,84.89 4.72,90.98 5.49,91.75 7.01,91.75 11.73,96.47 11.73,97.99 J16.4
  Bottom 0.152: v23.55,58.85 22.74,59.66 R29.1 | v13.05,61.72 v7.62,61.72
6SDA  (via drill 0.35)
  Top 0.152: U1.17 25.06,58.44 v24.6,58.9 | v20.57,72.24 20.57,75.89 21.34,76.66 v21.34,84.28
  Bottom 0.152: v24.6,58.9 23.49,60.01 23.49,61.23 22.74,61.98 R30.2 22.71,62.33 22.71,65.08 18.75,69.04 18.75,70.41 v20.57,72.24 | v21.34,84.28 21.34,93.88 18.14,97.08 18.14,98.6 17.37,99.36 15.7,99.36 14.48,98.15 J16.3
7SCL  (via drill 0.35)
  Top 0.152: U1.20 22.84,57 22.84,57.32 21.83,58.33 19.08,58.33 v18.36,59.05 16.42,59.05 16.42,59.02 15.28,60.16 v11.75,60.16
  Bottom 0.152: v18.36,59.05 18.42,59.05 19.39,60.01 R33.1 | v11.75,60.16 7.12,60.16 7.01,60.05 4.88,60.05 2.9,62.03 2.9,100.28 4.72,102.11 33.68,102.11 37.19,98.6 37.19,97.54 36.42,96.77 34.75,96.77 33.53,97.99 J18.4
7SDA  (via drill 0.35)
  Top 0.152: U1.19 23.7,56.79 23.7,57.7 22.36,59.04 v20.1,59.04
  Bottom 0.152: v20.1,59.04 20.1,59.96 20.13,59.99 20.13,61.2 19.39,61.95 R34.2 19.36,62.33 19.36,63.4 17.83,64.92 17.22,64.92 14.78,62.48 5.49,62.48 4.12,63.86 4.12,94.34 4.57,94.79 6.25,94.79 11.12,99.67 33.53,99.67 35.05,98.15 35.81,98.15 J18.3
+3.3V  (via drill 0.35)
  Top 0.152: J1.2 44.97,23.51 42.75,23.51 | 42.75,23.51 D17.A | J16.2 16.92,98.15 17.22,98.15 18.44,99.36 37.19,99.36 38.41,98.15 J18.2 | J8.2 5.79,14.63 5.79,14.94 4.42,16.31 4.42,35.51 5.79,36.88 J10.2 5.79,37.03 4.42,38.41 4.42,56.39 5.79,57.76 5.79,58.67 J12.2 5.79,58.83 4.12,60.5 4.12,78.18 5.79,79.86 5.79,80.16 J14.2 | J6.2 24.99,4.88 26.52,3.35 36.27,3.35 37.34,4.42 37.34,5.33 38.25,6.25 39.17,6.25 39.93,5.49 39.93,4.57 40.84,3.66 44.96,3.66 46.18,4.88 J4.2 46.38,5 47.25,5.88 47.25,11 | 42.75,23.51 42.75,25.75 42.62,25.88 41.62,25.88 41.12,25.38 41.12,22.75 42,21.88 45.25,21.88 47.25,19.88 47.25,11 | 42.75,23.5 42.75,23.51 | C1.1 16.56,52.8 16.65,52.71 | 16.15,15.24 16.15,16.15 15.39,16.92 S8.3 | 16.15,15.24 16.15,14.33 15.39,13.56 15.39,12.65 S7.3 | S5.3 24.23,12.65 24.23,13.56 23.47,14.33 23.47,16.31 24.23,17.07 S6.3 | 41.15,16.15 41.15,14.33 41.91,13.56 41.91,12.65 S1.3 43.51,11 47.25,11 | 41.15,16.15 41.91,16.92 S2.3 42.98,18 v44,18 | 41.15,16.15 33.98,16.15 33.07,17.07 S4.3 32.92,17.07 32.16,16.31 32.16,14.33 32.92,13.56 32.92,12.65 S3.3 33.07,12.5 33.07,9.6 34.9,7.77 34.9,3.96 34.59,3.66 32.61,3.66 32.31,3.96 32.31,4.27 24.38,12.19 24.38,12.34 | 24.38,12.34 24.38,12.5 S5.3 | v16.61,15.24 16.15,15.24 | 24.38,12.34 v21.79,12.34 | 24.38,12.34 S5.3 | 23.47,85.04 23.47,87.17 24.23,87.94 S12.3 | 23.47,85.04 23.47,84.28 24.23,83.52 S11.3 24.38,83.52 26.36,83.52 | 16,85.04 16.15,85.19 16.15,87.17 15.39,87.94 S10.3 | 16,85.04 15.39,84.43 15.39,83.67 S9.3 | 16,85.04 23.47,85.04 | 33.22,84.12 33.22,84.73 33.98,85.5 33.98,87.33 | 33.22,84.12 33.22,83.67 S13.3
  Top 0.152: 33.98,87.33 33.22,88.09 S14.3 | S15.3 42.22,83.52 42.22,84.43 45.41,87.63 45.41,88.39 46.48,89.46 46.79,89.46 47.09,89.76 47.09,90.53 46.94,90.68 44.81,90.68 42.22,88.09 S16.3 42.06,87.94 41.45,87.33 33.98,87.33 | 26.36,83.52 27.28,83.52 27.89,84.12 33.22,84.12 | 26.36,83.52 26.36,74.83 27.13,74.07 27.13,73.3 23.77,69.95 23.77,67.67 v24.54,66.9 | C1.1 R54.2 16.62,55.03 R53.2 20.3,56.93 U1.24 20.51,56.58 v19.81,55.88 | C1.1 16.62,50.83 R58.2
  Bottom 0.152: J6.2 24.84,5.03 24.84,6.1 16.46,14.48 5.94,14.48 J8.2 | J16.2 16.76,97.99 16,97.99 12.5,94.49 4.72,94.49 4.42,94.18 4.42,81.69 5.79,80.31 J14.2 | 18.7,57.62 19.81,56.5 v19.81,55.88 22.88,55.88 26.59,52.17 26.59,51.74 30.32,48.01 30.32,45.31 29.71,44.7 29.21,44.7 | 18.7,57.62 17.93,57.62 17.18,58.38 17.18,59.86 R33.2 R34.1 | R30.1 R29.2 21.27,58.42 20.47,57.62 | R22.1 R21.2 27.98,58.52 27.08,57.62 24.78,57.62 | 18.7,57.62 20.47,57.62 | 20.47,57.62 24.78,57.62 | 24.78,57.62 25.33,58.17 25.33,59.95 R25.2 R26.1 24.54,62.33 v24.54,66.9 | 29.21,44.7 26.42,44.7 | 26.42,44.7 22.86,44.7 | 22.86,44.7 19.3,44.7 17.86,43.27 R6.1 R5.2 17.83,40.23 15.24,40.23 10.97,35.97 10.97,35.2 4.42,28.65 4.42,19.36 5.49,18.29 7.01,18.29 10.06,15.24 v16.61,15.24 18.9,15.24 v21.79,12.34 | 22.86,44.7 21.08,42.93 21.08,40.33 R9.2 R10.1 | 26.42,44.7 24.57,42.86 R13.2 R14.1 | 29.21,44.7 28.02,43.52 R17.2 R18.1
GND  (via drill 0.35)
  Top 0.152: 26.26,54.1 26.77,53.59 29.54,53.59 R56.2 | R56.2 R57.2 28.87,50.89 U1.12 | v36.3,57.2 36.02,56.92 34.39,56.92 32.99,58.32 32.48,58.32 | J2.1 42.76,33.86 R4.2 R3.2 | v23.9,2.6 42.2,2.6 v42.4,2.8 | v35.5,29.6 35.5,25.3 IC2.9 37.02,25.08 37.6,24.5 37.6,22 v38.1,21.5 | IC1.9 35.28,64.62 v35.3,64.6 | v12.6,58.9 12.6,52.82 15.94,49.48 17.6,49.48 17.6,51.66 18.52,52.59 C1.2 23.41,52.87 24.64,54.1 26.29,54.1 30.51,58.32 32.48,58.32 | v9.3,8.9 9.3,14.8 v8.3,15.8 | v17.5,95.7 19.42,97.62 J16.1 18.53,98.08 17.36,96.91 16.4,96.91 15.71,97.6 15.71,98.56 16.82,99.67 38.53,99.67 40.12,98.08 J18.1 | J14.1 5.92,81.94 3.81,79.83 v3.81,58.41 v3.8,58.4 3.8,41.3 v3.5,41 | v7.67,57.4 7.67,59.49 J12.1 | J4.1 43.78,9.82 42.3,11.3 40.4,11.3 39.5,12.2 39.5,13.6 v39.4,13.7 | 32.48,58.32 32.48,56.67 R55.2 31.48,55.53 R56.2
  Bottom 0.152: v36.3,57.2 36.3,55.99 R50.2 R49.2 | v36.3,57.2 36.3,58.77 R51.2 R52.2 36.1,62.33 | 36.1,62.33 36.55,62.33 37.26,61.62 38.6,61.62 R44.2 | R49.2 R48.2 | R48.2 R47.2 | R47.2 R46.2 | R46.2 R45.2 36.81,39.99 38.49,39.99 39.23,39.25 R37.2 42.19,36.4 | R38.2 39.23,42.55 38.49,43.29 36.81,43.29 R46.2 | R39.2 39.23,45.85 38.49,46.59 36.81,46.59 R47.2 | R40.2 39.23,49.15 38.49,49.89 36.81,49.89 R48.2 | R41.2 39.23,52.46 38.49,53.2 36.81,53.2 R49.2 | v36.3,57.2 37.9,57.2 37.95,57.15 | 37.95,57.15 R42.2 | 37.95,57.15 39.34,58.54 R43.2 | 42.19,36.4 J2.2 J2.1 | v23.9,2.6 23.9,3.4 J6.1 21.48,4.93 20.31,6.1 19.35,6.1 18.66,5.41 18.66,4.65 16.91,2.9 12.01,2.9 9.3,5.61 v9.3,8.9 | v42.4,2.8 43.78,4.18 J4.1 | 42.19,36.4 42.19,36.29 v35.5,29.6 | v35.3,64.6 35.3,63.13 36.1,62.33 | v12.6,58.9 12.6,60.5 12.09,61.01 7.33,61.01 7.1,61.24 J12.1 | v8.3,15.8 7.06,17.04 J8.1 | v14.5,94.1 16.1,95.7 v17.5,95.7 | v3.8,58.4 4.8,57.4 v7.67,57.4 | v3.5,41 4.38,41 J10.1 | v39.4,13.7 39.4,20.2 v38.1,21.5
  pour Top: 0,0 55,0 55,104 0,104
  pour Bottom: 0,0 55,0 55,104 0,104
IC1-11
  Bottom 0.152: J20.3 46.02,97.99 43.89,95.86 43.89,93.27 R36.1 43.74,93.12 43.74,89.46 32.77,78.49 32.77,77.27 IC1.11
IC1-12
  Bottom 0.152: 50.75,97.69 51.05,97.99 J20.1 50.75,97.69 | 50.75,97.69 49.38,96.32 49.38,93.27 R35.1 | 50.75,97.69 49.07,99.36 45.72,99.36 44.81,98.45 44.81,97.54 44.04,96.77 43.74,96.77 30.33,83.36 30.33,77.27 IC1.12
IC1-13
  Bottom 0.152: R32.1 22.55,93.12 22.55,96.16 24.38,97.99 J19.3 24.54,98.15 25.76,99.36 30.63,99.36 31.09,98.91 31.09,92.81 27.74,89.46 27.74,77.27 IC1.13
IC1-14
  Bottom 0.152: J19.1 29.57,97.99 27.58,96.01 27.58,93.12 R31.1 27.43,92.96 25.15,90.68 25.15,77.27 IC1.14
IC1-15
  Bottom 0.152: J17.3 5.94,87.78 7.62,86.11 10.97,86.11 R28.1 11.12,85.95 12.95,85.95 21.64,77.27 22.55,77.27 IC1.15
IC1-16
  Bottom 0.152: 6.25,92.66 5.94,92.96 J17.1 6.25,92.66 | 6.25,92.66 7.92,90.98 11.12,90.98 R27.1 | 6.25,92.66 4.72,91.14 4.72,87.33 5.33,86.72 6.25,86.72 7.77,85.19 11.73,85.19 19.66,77.27 19.96,77.27 IC1.16
IC1-17
  Bottom 0.152: J15.3 5.94,66.29 7.92,64.31 10.97,64.31 R24.1 11.12,64.31 11.89,65.08 11.89,69.04 17.37,74.52 17.37,77.11 IC1.17
IC1-18
  Top 0.152: IC1.18 14.94,77.11 11.58,77.11 5.94,71.48 J15.1
  Bottom 0.152: R23.1 11.12,69.65 14.94,73.46 14.94,77.11 IC1.18
IC2-11
  Top 0.152: IC2.11 32.61,32.77 32.61,34.9 26.21,41.3 13.72,41.3 11.58,43.43 7.01,43.43 5.94,44.5 J11.3
  Bottom 0.152: R20.1 11.12,42.67 7.77,42.67 5.94,44.5 J11.3
IC2-12
  Top 0.152: IC2.12 30.33,32.61 31.09,32.61 32.31,31.39 33.22,31.39 33.98,32.16 33.98,33.98 26.36,41.6 16.31,41.6 11.89,46.02 11.89,48.16 11.73,48.31 7.16,48.31 5.94,49.53 J11.1
  Bottom 0.152: R19.1 10.97,47.7 7.77,47.7 5.94,49.53 J11.1
IC2-13
  Bottom 0.152: J9.3 5.94,22.1 8.08,19.96 11.12,19.96 R16.1 11.28,19.96 11.58,19.96 16.15,24.54 16.15,25.45 17.37,26.67 20.88,26.67 26.82,32.61 27.58,32.61 IC2.13
IC2-14
  Bottom 0.152: J9.1 5.94,27.13 7.92,25.15 11.12,25.15 R15.1 11.28,25.15 11.89,25.15 13.72,26.98 19.05,26.98 24.69,32.61 24.99,32.61 IC2.14
IC2-15
  Top 0.152: IC2.15 22.55,32.61 22.55,26.82 21.34,25.6 21.34,22.55 21.64,22.25 21.64,13.26 18.59,10.21 18.59,6.25 17.37,5.03 J7.3
  Bottom 0.152: R12.1 19.36,9.6 19.36,7.01 17.37,5.03 J7.3
IC2-16
  Top 0.152: IC2.16 19.96,32.61 19.96,26.82 18.75,25.6 18.75,20.27 17.37,18.9 17.37,10.67 12.34,5.64 12.34,5.03 J7.1
  Bottom 0.152: R11.1 14.17,9.6 14.17,6.86 12.34,5.03 J7.1
IC2-17
  Top 0.152: IC2.17 17.37,32.61 14.02,29.26 13.87,29.26 13.41,28.8 13.41,11.73 10.67,8.99 10.67,3.81 11.43,3.05 17.65,3.05 18.3,3.7 25.3,3.7 25.95,3.05 36.73,3.05 38.56,4.88 J5.3
  Bottom 0.152: R8.1 40.54,9.75 40.54,6.86 38.71,5.03 J5.3
IC2-18
  Top 0.152: IC2.18 15.09,32.77 15.85,32.77 17.07,33.98 23.01,33.98 23.77,33.22 23.77,21.03 26.67,18.14 26.67,11.89 33.53,5.03 J5.1
  Bottom 0.152: R7.1 35.66,9.75 35.66,7.01 33.68,5.03 J5.1
N$1  (via drill 0.35)
  Top 0.152: D19.K 38.1,38.95 v38.1,37.7 | v38.5,34.25 38.5,24.29 41.3,21.49 45.11,21.49 46.94,19.66 46.94,16.61 46.18,15.85 46.18,14.78 S1.2 | v19.2,29.26 15.09,25.15 IC2.1
  Bottom 0.152: R37.1 38.1,39.02 v38.1,37.7 38.1,34.39 | v19.2,29.26 20.88,29.26 23.77,32.16 23.77,33.07 25.09,34.39 38.1,34.39 | v38.5,34.25 38.36,34.39 38.1,34.39
N$2
  Top 0.152: D19.A 46.37,39.38 J3.1
N$3
  Top 0.152: D20.A 47.13,42.68 J3.2
N$4
  Top 0.152: D21.A 47.31,45.98 J3.3
N$5
  Top 0.152: D22.A 46.55,49.28 J3.4
N$6
  Top 0.152: D23.A 42.12,52.58 43.93,50.77 J3.5
N$7
  Top 0.152: D24.A 40.81,55.89 43.4,53.3 J3.6
N$8
  Top 0.152: J3.7 45.05,55.85 41.71,59.19 D25.A
N$9  (via drill 0.35)
  Top 0.152: v42.98,45.26 41.3,43.59 37.49,43.59 37.03,43.13 37.03,42.52 36.12,41.6 36.12,39.47 D27.A
  Bottom 0.152: v42.98,45.26 47.24,49.53 48.01,49.53 48.77,50.29 48.77,60.96 47.7,62.03 J13.1
N$10  (via drill 0.35)
  Top 0.152: v34.6,38 34.6,39.28 D27.K 34.59,39.47 34.59,40.08 35.51,41 35.51,49.84 36.12,50.44 39.01,50.44 v39.78,51.21 | v19.81,73 18.75,74.07 18.75,77.72 14.48,81.99 14.48,88.39 14.78,88.7 16,88.7 18.9,85.8 19.51,85.8 S9.2
  Bottom 0.152: R45.1 34.57,38.03 v34.6,38 | IC1.1 15.09,69.65 18.44,73 v19.81,73 33.53,73 40.54,65.99 40.54,52.27 39.78,51.51 v39.78,51.21
N$11  (via drill 0.35)
  Top 0.152: U1.2 21.43,51.16 21.43,51.48 22.11,52.16 v27.6,52.16 | v32.67,52.7 31.74,53.63 R56.1
  Bottom 0.152: v27.6,52.16 32.12,52.16 v32.67,52.7
N$12  (via drill 0.35)
  Top 0.152: v31.5,50.29 31.5,51.58 R57.1 | U1.1 20.78,51.16 20.78,51.48 21.86,52.56 23.53,52.56 23.85,52.89 v26.9,52.89
  Bottom 0.152: v26.9,52.89 26.9,52.46 26.89,52.45 26.89,51.87 28.47,50.29 v31.5,50.29
N$13  (via drill 0.35)
  Top 0.152: D28.K 34.6,42.58 v34.6,41.2 34.59,41.15 27.28,41.15 26.52,41.91 16.46,41.91 12.19,46.18 12.19,58 10.6,59.59 10.6,61.41 12.19,63 12.19,65.99 v12.8,66.6 | v14.17,81.23 14.17,88.54 14.63,89 15.39,89 16.46,90.07 19.36,90.07 S10.2
  Bottom 0.152: v34.6,41.2 34.6,42.49 R46.1 | v14.17,81.23 15.24,81.23 18.75,77.72 18.75,75.44 13.72,70.41 13.72,69.04 14.48,68.28 | 14.48,68.28 16.15,68.28 17.37,69.49 IC1.2 | 14.48,68.28 v12.8,66.6
N$14  (via drill 0.35)
  Top 0.152: U1.21 22.73,56.46 22.73,56.14 23.43,55.44 v26.24,55.44 | v27.92,54.48 28.39,54.48 R55.1
  Bottom 0.152: v26.24,55.44 26.96,55.44 v27.92,54.48
N$18
  Top 0.152: D30.A 36.12,49.38 36.73,49.38 37.34,49.99 46.63,49.99 47.09,49.53 48.01,49.53 49.07,50.6 49.07,72.54 48.16,73.46 47.09,73.46 46.33,72.69 46.33,71.02 47.55,69.8 J13.4
N$19  (via drill 0.35)
  Top 0.152: v41.3,45.26 39.93,43.89 37.19,43.89 36.12,42.82 D28.A
  Bottom 0.152: v41.3,45.26 41.3,46.02 46.33,51.05 46.33,63.4 47.55,64.62 J13.2
N$21  (via drill 0.35)
  Top 0.152: v41.3,47.09 37.64,47.09 36.58,46.02 36.12,46.02 D29.A
  Bottom 0.152: v41.3,47.09 41.3,60.81 47.55,67.06 J13.3
N$22
  Top 0.152: D34.A 36.12,62.33 36.12,66.29 46.33,76.5 46.33,78.64 47.55,79.86 J13.8
N$23
  Top 0.152: D33.A 36.12,59.28 36.12,61.11 37.03,62.03 37.03,66.75 47.55,77.27 J13.7
N$26  (via drill 0.35)
  Top 0.152: v34.3,94.34 25.3,94.34 v24.99,94.03 24.08,93.12 D14.C
  Bottom 0.152: v24.99,94.03 24.84,94.03 23.93,93.12 R32.2
N$27  (via drill 0.35)
  Top 0.152: v51.91,93.2 50.84,93.2 D15.C
  Bottom 0.152: v51.91,93.2 50.84,93.2 R35.2
N$30
  Top 0.152: D26.A 40.81,62.19 44.61,58.39 J3.8
N$32
  Top 0.152: D32.A 36.12,55.93 38.71,58.52 38.71,62.79 43.59,67.67 44.2,67.67 46.02,69.49 46.02,73.15 47.55,74.68 J13.6
N$34  (via drill 0.35)
  Top 0.152: D20.K 37.9,42.45 v37.9,41.2 37.8,41.15 37.8,40.54 36.93,39.68 36.93,33.63 v36.83,33.53 | v29.72,17.87 v29.72,17.88 41.96,17.88 43.13,19.05 46.02,19.05 S2.2
  Bottom 0.152: R38.1 37.87,41.23 v37.9,41.2 | v29.72,17.87 20.84,17.87 17.53,21.18 17.53,24.99 IC2.2 17.53,25.15 18.75,26.36 21.03,26.36 23.16,28.5 32.92,28.5 36.83,32.41 v36.83,33.53
N$36  (via drill 0.35)
  Top 0.152: D21.K 37.7,45.96 v37.7,44.6 | v34.29,14.78 37.03,14.78 S3.2
  Bottom 0.152: R39.1 37.7,45.68 v37.7,44.6 37.8,44.5 40.54,44.5 47.4,37.64 47.85,37.64 48.62,36.88 48.62,32.77 48.46,32.61 39.93,32.61 35.51,28.19 23.32,28.19 20.12,24.99 | v34.29,14.78 34.08,14.78 30.27,18.59 20.57,18.59 20.12,19.05 20.12,24.99 | 20.12,24.99 IC2.3
N$37  (via drill 0.35)
  Top 0.152: D22.K 37.9,49.06 v37.9,47.9 37.95,47.85 46.33,47.85 47.24,46.94 48.01,46.94 49.84,45.11 v49.84,29.26 | v29.72,27.43 29.72,26.67 28.96,25.91 28.96,24.54 34.14,19.36 37.03,19.36 S4.2
  Bottom 0.152: R40.1 37.87,47.93 v37.9,47.9 | v29.72,27.43 24.99,27.43 23.01,25.45 | 23.01,25.45 22.71,25.15 IC2.4 23.01,25.45 | v49.84,29.26 47.85,27.28 43.43,27.28 39.17,23.01 35.51,23.01 33.98,24.54 33.98,25.6 33.22,26.36 27.13,26.36 26.36,25.6 26.36,24.54 25.6,23.77 24.69,23.77 23.01,25.45
N$38  (via drill 0.35)
  Top 0.152: D23.K 37.8,52.46 v37.8,51.2 | S5.2 28.35,14.78 28.35,16 26.98,17.37 26.98,23.16 25.15,24.99 IC2.5
  Bottom 0.152: R41.1 37.8,52.38 v37.8,51.2 37.95,51.05 38.86,51.05 40.54,49.38 40.54,44.96 47.55,37.95 48.01,37.95 48.92,37.03 48.92,32.61 48.62,32.31 40.08,32.31 34.44,26.67 26.67,26.67 25.15,25.15 IC2.5
N$39  (via drill 0.35)
  Top 0.152: D24.K 37.8,55.76 v37.8,54.5 37.8,54.41 35.51,54.41 34.44,53.34 34.14,53.34 33.38,52.58 v33.38,41.91 | S6.2 28.35,19.36 28.35,24.38 27.74,24.99 IC2.6 27.74,25.15 28.96,26.36 v28.96,37.49
  Bottom 0.152: R42.1 37.87,54.57 v37.8,54.5 | v28.96,37.49 v33.38,41.91
N$40  (via drill 0.35)
  Top 0.152: D25.K 37.68,60.48 v37.7,60.5 37.8,60.5 37.8,61.27 38.41,61.87 38.41,62.94 v43.89,68.43 | v20.88,21.95 18.59,19.66 18.59,16.61 19.36,15.85 19.36,14.78 S7.2 | v36.27,23.77 31.55,23.77 30.33,24.99 IC2.7
  Bottom 0.152: v37.7,60.5 37.7,59.23 R43.1 | v20.88,21.95 27.13,21.95 30.18,24.99 IC2.7 | v43.89,68.43 48.01,68.43 49.23,67.21 49.23,31.09 47.85,29.72 45.41,29.72 39.47,23.77 v36.27,23.77
N$41  (via drill 0.35)
  Top 0.152: D26.K 37.9,62.41 v37.9,63.6 37.95,63.7 v45.26,71.02 | v20.88,19.36 19.51,19.36 S8.2
  Bottom 0.152: R44.1 37.87,63.57 v37.9,63.6 | v20.88,19.36 26.98,19.36 32.61,24.99 IC2.8 32.77,24.99 35.05,22.71 39.32,22.71 41.3,24.69 47.85,24.69 50.6,27.43 50.6,68.43 48.01,71.02 v45.26,71.02
N$42  (via drill 0.35)
  Top 0.152: v34.6,44.6 34.6,45.89 D29.K | v24.38,84.58 24.54,84.58 25.45,85.5 28.35,85.5 S11.2 | v17.53,73.15 17.53,72.08 19.96,69.65 IC1.3
  Bottom 0.152: v34.6,44.6 34.6,45.79 R47.1 34.44,45.87 34.44,46.94 33.53,47.85 33.53,53.8 33.26,54.06 33.26,56.97 30.63,59.6 30.63,62.48 24.84,68.28 21.34,68.28 20.12,69.49 IC1.3 | v24.38,84.58 24.38,78.18 23.77,77.57 23.77,76.5 21.03,73.76 18.14,73.76 v17.53,73.15
N$43
  Top 0.152: D31.A 36.12,52.73 37.03,53.65 37.95,53.65 38.71,54.41 38.71,56.39 38.86,56.54 43.89,56.54 45.72,54.71 48.16,54.71 48.77,55.32 48.77,71.17 47.7,72.24 J13.5
N$44  (via drill 0.35)
  Top 0.152: v34.6,47.9 34.6,49.19 D30.K 34.59,49.38 34.59,49.99 37.03,52.43 37.03,53.03 37.34,53.34 38.41,53.34 v39.62,54.56 | v26.36,88.09 28.35,90.07 S12.2 | v26.36,73.76 26.36,73.3 22.71,69.65 IC1.4
  Bottom 0.152: v34.6,47.9 34.6,49.09 R48.1 | v26.36,73.76 v26.36,88.09 | v39.62,54.56 40.23,55.17 40.23,62.94 34.9,68.28 34.75,68.28 33.98,69.04 33.98,70.1 33.38,70.71 23.77,70.71 22.71,69.65 IC1.4
N$45  (via drill 0.35)
  Top 0.152: v34.6,51.1 34.6,52.49 D31.K | S13.2 37.19,85.8 37.19,84.89 31.39,79.1 31.39,75.89 25.15,69.65 IC1.5
  Bottom 0.152: v34.6,51.1 34.6,52.4 R49.1 34.44,52.58 34.44,53.34 33.57,54.21 33.57,57.21 30.94,59.84 30.94,63.7 25.15,69.49 IC1.5
N$46  (via drill 0.35)
  Top 0.152: D32.K v34.51,54.41 v34.5,54.4 | v37.19,89.15 37.19,90.22 S14.2 | v31.39,73.76 31.39,73.3 27.74,69.65 IC1.6
  Bottom 0.152: v34.5,54.4 34.5,55.66 R50.1 34.44,55.78 34.44,56.84 31.24,60.05 31.24,65.99 27.74,69.49 IC1.6 | v37.19,89.15 37.19,83.36 31.39,77.57 v31.39,73.76
N$47  (via drill 0.35)
  Top 0.152: v34.6,57.71 34.51,57.8 D33.K 34.44,59.28 34.44,60.05 33.22,61.27 33.22,68.28 | 33.22,68.28 33.98,69.04 33.98,69.95 34.29,70.26 34.29,73.3 46.18,85.19 46.18,85.5 S15.2 | 33.22,68.28 31.55,68.28 30.33,69.49 IC1.7
  Bottom 0.152: R51.1 34.57,57.74 v34.6,57.71
N$48  (via drill 0.35)
  Top 0.152: D34.K v34.51,61.01 v34.5,61 | S16.2 46.18,90.07 45.41,90.07 41.6,86.26 41.45,86.26 33.98,78.79 33.98,70.87 32.77,69.65 IC1.8
  Bottom 0.152: v34.5,61 34.5,62.26 R52.1 34.44,62.48 34.44,67.82 32.77,69.49 IC1.8
N$49  (via drill 0.35)
  Top 0.152: v46.53,93.2 45.46,93.2 D16.C
  Bottom 0.152: v46.53,93.2 45.46,93.2 R36.2
N$50  (via drill 0.35)
  Top 0.152: v9.91,87.47 10.97,87.47 D12.C
  Bottom 0.152: v9.91,87.47 10.97,87.47 R28.2
N$51  (via drill 0.35)
  Top 0.152: v30.34,93.12 29.27,93.12 D13.C
  Bottom 0.152: v30.34,93.12 D13.C R31.2
N$52  (via drill 0.35)
  Top 0.152: v11.21,93.58 11.21,92.52 D11.C
  Bottom 0.152: v11.21,93.58 11.21,92.36 R27.2
N$53  (via drill 0.35)
  Top 0.152: v9.91,65.83 D10.C
  Bottom 0.152: v9.91,65.83 10.97,65.83 R24.2
N$54  (via drill 0.35)
  Top 0.152: v9.91,71.04 11.12,71.04 D9.C
  Bottom 0.152: v9.91,71.04 10.97,71.04 R23.2
N$55  (via drill 0.35)
  Top 0.152: v11.28,45.26 11.28,44.2 D8.C
  Bottom 0.152: v11.28,45.26 11.28,44.2 R20.2
N$56  (via drill 0.35)
  Top 0.152: v9.91,49.07 11.12,49.07 D7.C
  Bottom 0.152: v9.91,49.07 10.97,49.07 R19.2
N$59  (via drill 0.35)
  Top 0.152: v11.28,22.71 11.28,21.64 D6.C
  Bottom 0.152: v11.28,22.71 11.28,21.49 R16.2
N$60  (via drill 0.35)
  Top 0.152: v34.14,10.97 34.14,9.91 D1.C
  Bottom 0.152: v34.14,10.97 34.14,9.91 R7.2
N$61  (via drill 0.35)
  Top 0.152: v39.32,24.69 40.39,23.62 D17.C | v39.62,30.02 40.54,30.94 R3.1
  Bottom 0.152: v39.32,24.69 39.32,29.72 v39.62,30.02
N$62
  Top 0.152: D18.C 40.39,25.15 40.39,26.21 38.86,27.74 38.86,31.39 40.54,33.07 R4.1
N$63  (via drill 0.35)
  Top 0.152: v12.34,26.67 11.28,26.67 D5.C
  Bottom 0.152: v12.34,26.67 11.28,26.67 R15.2
N$64  (via drill 0.35)
  Top 0.152: v17.83,8.53 17.83,9.75 D4.C
  Bottom 0.152: v17.83,8.53 17.83,9.6 R12.2
N$65  (via drill 0.35)
  Top 0.152: v12.8,8.53 12.8,9.75 D3.C
  Bottom 0.152: v12.8,8.53 12.8,9.6 R11.2
N$66  (via drill 0.35)
  Top 0.152: v39.17,8.69 39.17,9.75 D2.C
  Bottom 0.152: v39.17,8.69 39.17,9.75 R8.2
RESET
  Top 0.152: U1.3 21.81,50.33 21.36,49.88 20.26,49.88 19.35,50.8 R58.1
SCL  (via drill 0.35)
  Top 0.152: 20.5,55 21.75,56.25 21.75,56.62 U1.22 | 20.5,55 18.62,55 R54.1 | v20.5,54.62 20.5,55 | v30.62,44.5 v29.5,45.62 | v26.38,36 26.38,24.25 27.62,23 27.62,18.88 27.88,18.62 37.75,18.62 38.88,19.75 38.88,23.38 38,24.25 38,28.62 v37.75,28.88 | v40.88,29.88 46.25,29.88 47.38,31 J1.4
  Bottom 0.152: v29.5,45.62 v20.5,54.62 | v30.62,44.5 30.62,40 28.88,38.25 28.62,38.25 v26.38,36 | v37.75,28.88 37.75,29.25 39.25,30.75 40,30.75 v40.88,29.88
SDA  (via drill 0.35)
  Top 0.152: U1.23 21.12,56.75 21.12,57.12 20.25,58 17.62,58 16.62,57 R53.1 16.5,56.88 v14.75,56.88 | v3,54.88 3,92.38 6.5,95.88 7.88,95.88 12,100 48.38,100 49.88,98.5 v49.88,67.5
  Bottom 0.152: v14.75,56.88 14.12,56.88 9.62,52.38 5.5,52.38 v3,54.88 | v49.88,67.5 49.88,31 47.5,28.62 J1.3
VCC  (via drill 0.35)
  Top 0.152: IC2.10 37.37,32.7 37.6,32.93 37.6,34.6 38.13,35.13 48.36,35.13 49,34.49 49,25 J1.1 45.32,23.43 44.7,22.81 41.6,22.81 41.46,22.95 41.46,24.07 42.1,24.7 D18.A | 40.84,7.62 40.84,5.33 41.15,5.03 J5.4 | 40.84,7.62 40.84,9.75 D2.A | 35.81,7.62 35.81,5.33 36.12,5.03 J5.2 | 35.81,7.62 35.81,9.75 D1.A | 35.81,7.62 40.84,7.62 | 19.51,5.33 19.51,9.75 D4.A | 19.51,5.33 19.81,5.03 J7.4 19.51,5.33 | D3.A 14.33,9.75 14.33,8.99 11.58,6.25 11.28,6.25 10.97,5.94 10.97,3.96 11.28,3.66 13.41,3.66 14.63,4.88 J7.2 14.78,4.88 16,3.66 17.83,3.66 19.51,5.33 | 8.69,19.81 6.1,19.81 5.94,19.66 J9.4 | 8.69,19.81 11.12,19.81 D6.A | 8.69,24.99 6.25,24.99 5.94,24.69 J9.2 | 8.69,24.99 11.12,24.99 D5.A 11.28,25.15 11.89,25.15 13.11,26.36 13.11,34.59 14.02,35.51 14.02,39.62 11.28,42.37 D8.A 11.12,42.37 6.25,42.37 | 8.69,24.99 8.69,19.81 | D7.A 11.12,47.55 6.4,47.55 5.94,47.09 J11.2 | 6.25,42.37 5.94,42.06 J11.4 6.25,42.37 | 6.25,42.37 4.72,43.89 4.72,45.11 5.79,46.18 5.79,46.94 J11.2 | 43.74,95.56 43.74,97.84 43.59,97.99 J20.4 | 43.74,95.56 43.74,93.57 | 43.74,93.57 43.74,93.27 D16.A 43.74,93.57 | 49.07,95.56 49.07,97.69 48.77,97.99 J20.2 | 49.07,95.56 49.07,93.27 D15.A 49.07,93.12 49.07,89.46 46.94,87.33 46.63,87.33 45.41,86.11 45.41,85.5 37.19,77.27 35.36,77.27 IC1.10 | 49.07,95.56 43.74,95.56 | 22.25,96.77 22.25,97.84 22.1,97.99 J19.4 | 22.25,96.77 22.25,93.12 D14.A | D14.A 22.4,92.96 23.16,92.2 24.38,92.2 25.3,93.12 27.43,93.12 D13.A 27.58,93.27 28.19,93.88 30.63,93.88 30.94,93.57 43.74,93.57 | 22.25,96.77 24.99,96.77 26.21,97.99 26.98,97.99 J19.2 | 8.69,90.83 6.25,90.83 5.94,90.53 J17.2
  Top 0.152: 8.69,90.83 11.12,90.83 D11.A 11.28,90.98 13.26,92.96 22.25,92.96 D14.A | 7.16,64.16 6.25,64.16 5.94,63.86 J15.4 | 7.16,64.16 8.38,64.16 | 8.38,64.16 10.97,64.16 D10.A | v8.38,69.19 8.53,69.34 11.12,69.34 D9.A | 8.69,85.8 6.25,85.8 5.94,85.5 J17.4 | 8.69,85.8 10.97,85.8 D12.A | 7.16,64.16 7.16,67.51 5.94,68.73 J15.2 | 8.69,85.8 8.69,90.83 | 8.38,64.16 8.38,54.41 4.72,50.75 4.72,48.16 5.79,47.09 J11.2
  Bottom 0.152: 31.55,3.05 33.98,3.05 35.81,4.88 36.12,4.88 J5.2 | J7.4 19.96,4.88 23.19,1.65 31.55,1.65 31.55,3.05 | J1.1 47.4,23.32 47.4,11.28 41.15,5.03 J5.4 | 7.16,69.19 6.25,69.19 5.94,68.89 J15.2 | 7.16,69.19 v8.38,69.19 | 7.16,69.19 7.16,83.82 5.94,85.04 5.94,85.34 J17.4 | 31.55,3.05 31.55,5.49 17.68,19.36 12.5,19.36 11.89,18.75 6.71,18.75 5.94,19.51 J9.4
(copper drawn outside any net)
  shapes: Top area x2

### Text on the board
tPlace: CH7 | -in/out+ | CH8 | -in/out+ | -in/out+ | OUT | CH5 | CH6 | CH7 | CH8 | IN | CH6 | CH8 | in/out | -in/out+ | in/out | CH7 | in/out | CH6 | in/out | CH5 | CH5 | CH4 | in/out | CH3 | in/out | -in/out+ | CH2 | in/out | PAM Controller_v3 | CH1 | in/out | CH4 | GND | GND | SCL | SDA | +3.3V | -in/out+ | VCC | OUT | CH3 | CH4 | CH3 | CH2 | CH1 | IN | -in/out+ | CH2 | -in/out+ | CH1